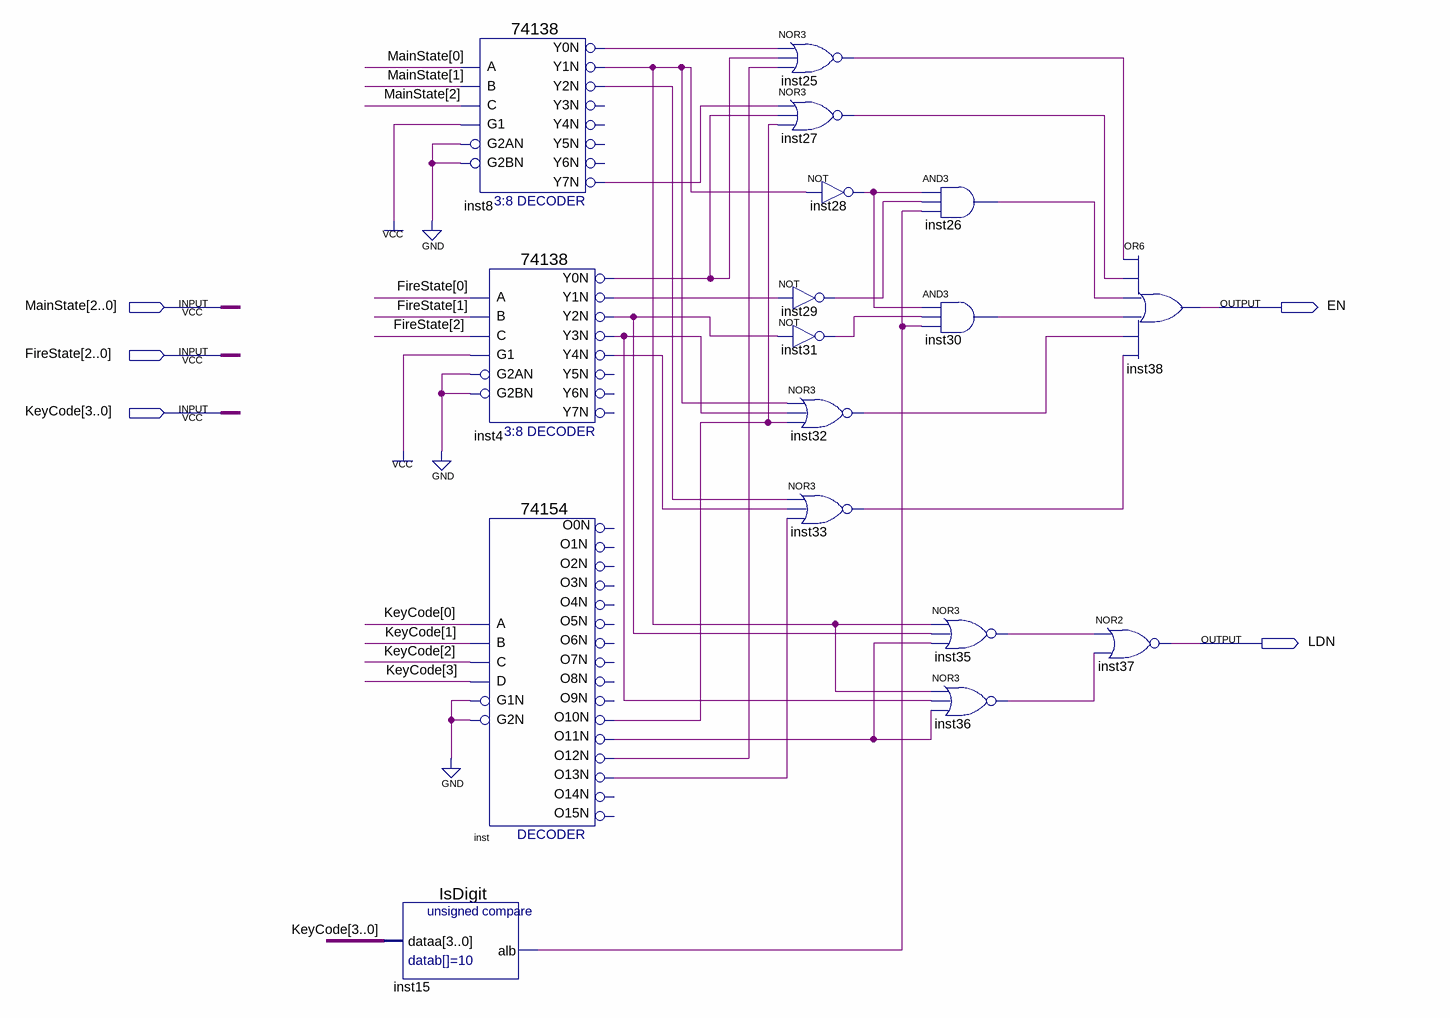
[diagram p0: schematic sheet]
// Quartus schematic FireStatusControl.bdf as structural Verilog: 17 symbols, 5 pins
module FireStatusControl (
  input  [2:0] MainState,
  input  [2:0] FireState,
  input  [3:0] KeyCode,
  output EN,
  output LDN
);

  wire inst4_y0n, inst4_y1n, inst4_y2n, inst4_y3n, inst4_y4n, inst8_y0n, inst8_y1n, inst8_y2n, inst8_y7n,
       inst15_alb, inst25_out, inst26_out, inst27_out, inst28_out, inst29_out, inst30_out, inst31_out,
       inst32_out, inst33_out, inst35_out, inst36_out, inst_o10n, inst_o11n, inst_o12n, inst_o13n;

  IsDigit inst15 (.dataa(KeyCode), .alb(inst15_alb));
  \74138  inst8 (
    .A(MainState[0]), .B(MainState[1]), .G1(1'b1), .C(MainState[2]), .G2AN(1'b0), .G2BN(1'b0),
    .Y0N(inst8_y0n), .Y1N(inst8_y1n), .Y2N(inst8_y2n), .Y7N(inst8_y7n));  // open: Y3N, Y4N, Y5N, Y6N
  \74138  inst4 (
    .A(FireState[0]), .B(FireState[1]), .G1(1'b1), .C(FireState[2]), .G2AN(1'b0), .G2BN(1'b0),
    .Y0N(inst4_y0n), .Y1N(inst4_y1n), .Y2N(inst4_y2n), .Y3N(inst4_y3n), .Y4N(inst4_y4n));  // open: Y5N, Y6N, Y7N
  \74154  inst (
    .C(KeyCode[2]), .D(KeyCode[3]), .B(KeyCode[1]), .A(KeyCode[0]), .G1N(1'b0), .G2N(1'b0), .O12N(inst_o12n),
    .O10N(inst_o10n), .O11N(inst_o11n), .O13N(inst_o13n));  // open: O0N, O15N, O1N, O14N, O4N, O3N, O2N, O7N, O6N, O5N, O9N, O8N
  nor inst25 (inst25_out, inst8_y0n, inst4_y0n, inst_o12n);
  nor inst27 (inst27_out, inst8_y7n, inst4_y0n, inst_o10n);
  not inst28 (inst28_out, inst8_y1n);
  not inst29 (inst29_out, inst4_y1n);
  not inst31 (inst31_out, inst4_y2n);
  nor inst32 (inst32_out, inst8_y1n, inst4_y3n, inst_o10n);
  nor inst33 (inst33_out, inst8_y2n, inst4_y4n, inst_o13n);
  and inst26 (inst26_out, inst28_out, inst29_out, inst15_alb);
  and inst30 (inst30_out, inst28_out, inst31_out, inst15_alb);
  nor inst35 (inst35_out, inst8_y1n, inst4_y2n, inst_o11n);
  nor inst36 (inst36_out, inst8_y1n, inst4_y3n, inst_o11n);
  or inst38 (EN, inst25_out, inst27_out, inst26_out, inst30_out, inst32_out, inst33_out);
  nor inst37 (LDN, inst35_out, inst36_out);
endmodule
